# Altium schematic sheet Fri3D_IRA_ESP32.SchDoc: ESP32 Module
size A3; Date: 26/12/2021; DrawnBy: Wim Van Gool; DocumentNumber: 2; Revision: 01; SheetNumber: 2; SheetTotal: 4
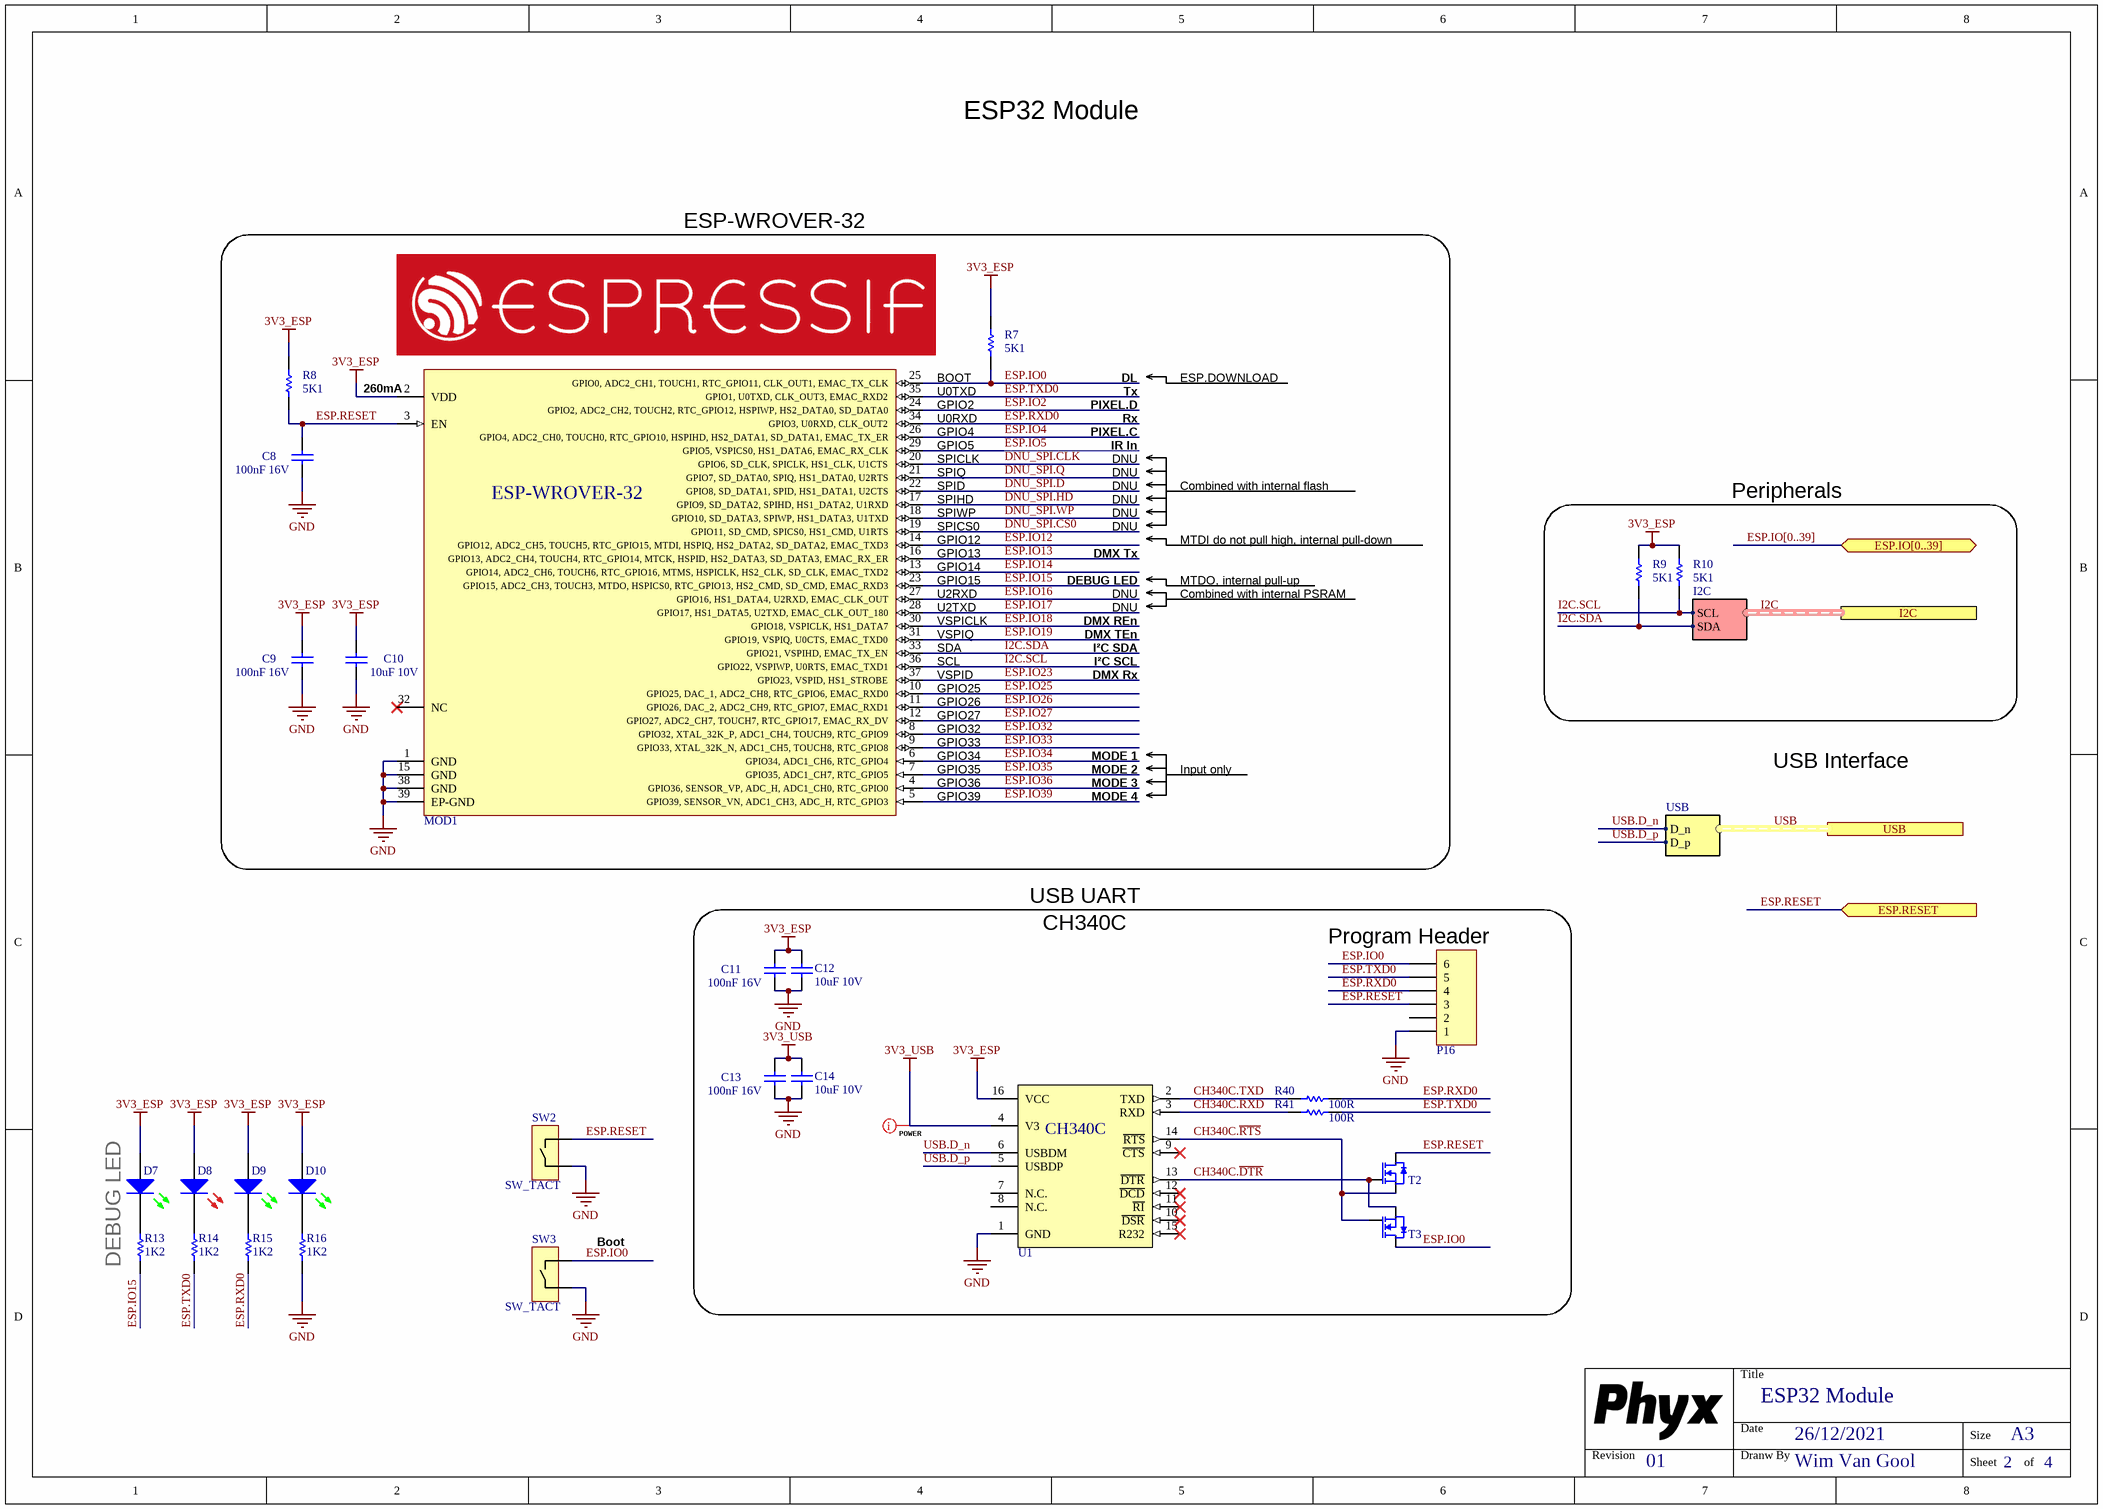
[diagram p0: Fri3D_IRA_ESP32.SchDoc]

## Parts
C8  value 100nF 16V  [C0603_N]
C9  value 100nF 16V  [C0603_N]
C10  value 10uF 10V  [C0805_N]  (hidden comment: CAP_CERAMIC)
C11  value 100nF 16V  [C0603_N]
C12  value 10uF 10V  [C0805_N]  (hidden comment: CAP_CERAMIC)
C13  value 100nF 16V  [C0603_N]
C14  value 10uF 10V  [C0805_N]  (hidden comment: CAP_CERAMIC)
D7  Default 0805 Green LED  [LED_0805_GR]  (value not drawn)
D8  Default 0805 Red LED  [LED_0805_RD]  (value not drawn)
D9  Default 0805 Green LED  [LED_0805_GR]  (value not drawn)
D10  Default 0805 Green LED  [LED_0805_GR]  (value not drawn)
MOD1  ESP-32 based ESP-WROVER-32  [ESP-WROVER-32]  (value not drawn)
P16  Header 6  [HDR1X6]  (value not drawn)
R7  value 5K1  [R0603_N]  (hidden comment: RESISTOR)
R8  value 5K1  [R0603_N]  (hidden comment: RESISTOR)
R9  value 5K1  [R0603_N]  (hidden comment: RESISTOR)
R10  value 5K1  [R0603_N]  (hidden comment: RESISTOR)
R13  value 1K2  [R0603_N]  (hidden comment: RESISTOR)
R14  value 1K2  [R0603_N]  (hidden comment: RESISTOR)
R15  value 1K2  [R0603_N]  (hidden comment: RESISTOR)
R16  value 1K2  [R0603_N]  (hidden comment: RESISTOR)
R40  value 100R  [R0603_N]  (hidden comment: RESISTOR)
R41  value 100R  [R0603_N]  (hidden comment: RESISTOR)
SW2  SW_TACT  [WE_430181038816]
SW3  SW_TACT  [WE_430181038816]
T2  0.2A N-Ch MOSFET Vgs 3.2  [SOT23-3]  (value not drawn)
T3  0.2A N-Ch MOSFET Vgs 3.2  [SOT23-3]  (value not drawn)
U1  USB to full UART with internal crystal  [SOIC_N_16]  (value not drawn)

## Blocks framed on the sheet
ESP-WROVER-32: C8-C10 MOD1 R7 R8
Peripherals: R9 R10

## Ports
ESP.IO[0..39] (bidir), ESP.RESET (in), I2C (harness I2C), USB (harness USB)

## Harnesses
I2C: SDA, SCL
USB: D_p, D_n

## Nets
3V3_ESP: C9.1 C10.1 C11.1 C12.2 D7.1(A) D8.1(A) D9.1(A) D10.1(A) MOD1.2(VDD) R7.1 R8.1 R9.1 R10.1 U1.16(VCC)
3V3_USB: C13.1 C14.2 U1.4(V3)
GND: C8.2 C9.2 C10.2 C11.2 C12.1 C13.2 C14.1 MOD1.1(GND) MOD1.15(GND) MOD1.38(GND) MOD1.39(EP-GND) P16.1 R16.2 SW2.2 SW3.2 U1.1(GND)
CH340C.~{DTR}: T2.1(G) T3.2(S) U1.13(~{DTR})
CH340C.~{RTS}: T2.2(S) T3.1(G) U1.14(~{RTS})
CH340C.RXD: R41.1 U1.3(RXD)
CH340C.TXD: R40.1 U1.2(TXD)
DNU_SPI.CLK: MOD1.20(GPIO6,_SD_CLK,_SPICLK,_HS1_CLK,_U1CTS)
DNU_SPI.CS0: MOD1.19(GPIO11,_SD_CMD,_SPICS0,_HS1_CMD,_U1RTS)
DNU_SPI.D: MOD1.22(GPIO8,_SD_DATA1,_SPID,_HS1_DATA1,_U2CTS)
DNU_SPI.HD: MOD1.17(GPIO9,_SD_DATA2,_SPIHD,_HS1_DATA2,_U1RXD)
DNU_SPI.Q: MOD1.21(GPIO7,_SD_DATA0,_SPIQ,_HS1_DATA0,_U2RTS)
DNU_SPI.WP: MOD1.18(GPIO10,_SD_DATA3,_SPIWP,_HS1_DATA3,_U1TXD)
ESP.IO0: MOD1.25(GPIO0,_ADC2_CH1,_TOUCH1,_RTC_GPIO11,_CLK_OUT1,_EMAC_TX_CLK) P16.6 R7.2 SW3.1 T3.3(D)
ESP.IO2: MOD1.24(GPIO2,_ADC2_CH2,_TOUCH2,_RTC_GPIO12,_HSPIWP,_HS2_DATA0,_SD_DATA0)
ESP.IO4: MOD1.26(GPIO4,_ADC2_CH0,_TOUCH0,_RTC_GPIO10,_HSPIHD,_HS2_DATA1,_SD_DATA1,_EMAC_TX_ER)
ESP.IO5: MOD1.29(GPIO5,_VSPICS0,_HS1_DATA6,_EMAC_RX_CLK)
ESP.IO12: MOD1.14(GPIO12,_ADC2_CH5,_TOUCH5,_RTC_GPIO15,_MTDI,_HSPIQ,_HS2_DATA2,_SD_DATA2,_EMAC_TXD3)
ESP.IO13: MOD1.16(GPIO13,_ADC2_CH4,_TOUCH4,_RTC_GPIO14,_MTCK,_HSPID,_HS2_DATA3,_SD_DATA3,_EMAC_RX_ER)
ESP.IO14: MOD1.13(GPIO14,_ADC2_CH6,_TOUCH6,_RTC_GPIO16,_MTMS,_HSPICLK,_HS2_CLK,_SD_CLK,_EMAC_TXD2)
ESP.IO15: MOD1.23(GPIO15,_ADC2_CH3,_TOUCH3,_MTDO,_HSPICS0,_RTC_GPIO13,_HS2_CMD,_SD_CMD,_EMAC_RXD3) R13.2
ESP.IO16: MOD1.27(GPIO16,_HS1_DATA4,_U2RXD,_EMAC_CLK_OUT)
ESP.IO17: MOD1.28(GPIO17,_HS1_DATA5,_U2TXD,_EMAC_CLK_OUT_180)
ESP.IO18: MOD1.30(GPIO18,_VSPICLK,_HS1_DATA7)
ESP.IO19: MOD1.31(GPIO19,_VSPIQ,_U0CTS,_EMAC_TXD0)
ESP.IO23: MOD1.37(GPIO23,_VSPID,_HS1_STROBE)
ESP.IO25: MOD1.10(GPIO25,_DAC_1,_ADC2_CH8,_RTC_GPIO6,_EMAC_RXD0)
ESP.IO26: MOD1.11(GPIO26,_DAC_2,_ADC2_CH9,_RTC_GPIO7,_EMAC_RXD1)
ESP.IO27: MOD1.12(GPIO27,_ADC2_CH7,_TOUCH7,_RTC_GPIO17,_EMAC_RX_DV)
ESP.IO32: MOD1.8(GPIO32,_XTAL_32K_P,_ADC1_CH4,_TOUCH9,_RTC_GPIO9)
ESP.IO33: MOD1.9(GPIO33,_XTAL_32K_N,_ADC1_CH5,_TOUCH8,_RTC_GPIO8)
ESP.IO34: MOD1.6(GPIO34,_ADC1_CH6,_RTC_GPIO4)
ESP.IO35: MOD1.7(GPIO35,_ADC1_CH7,_RTC_GPIO5)
ESP.IO36: MOD1.4(GPIO36,_SENSOR_VP,_ADC_H,_ADC1_CH0,_RTC_GPIO0)
ESP.IO39: MOD1.5(GPIO39,_SENSOR_VN,_ADC1_CH3,_ADC_H,_RTC_GPIO3)
ESP.RESET: C8.1 MOD1.3(EN) P16.3 R8.2 SW2.1 T2.3(D) ; port ESP.RESET
ESP.RXD0: MOD1.34(GPIO3,_U0RXD,_CLK_OUT2) P16.4 R15.2 R40.2
ESP.TXD0: MOD1.35(GPIO1,_U0TXD,_CLK_OUT3,_EMAC_RXD2) P16.5 R14.2 R41.2
I2C.SCL: MOD1.36(GPIO22,_VSPIWP,_U0RTS,_EMAC_TXD1) R10.2 ; port I2C.SCL
I2C.SDA: MOD1.33(GPIO21,_VSPIHD,_EMAC_TX_EN) R9.2 ; port I2C.SDA
USB.D_n: U1.6(USBDM) ; port USB.D_n
USB.D_p: U1.5(USBDP) ; port USB.D_p
NetD7_2: D7.2(K) R13.1
NetD8_2: D8.2(K) R14.1
NetD9_2: D9.2(K) R15.1
NetD10_2: D10.2(K) R16.1

Not connected (* = marked no-connect by the designer): MOD1 32(NC)*; P16 2; U1 7(N.C.) 8(N.C.) 9(~{CTS})* 10(~{DSR})* 11(~{RI})* 12(~{DCD})* 15(R232)*

## Buses and harness runs
bus ESP.IO[0..39] = port ESP.IO[0..39]
harness I2C = port I2C
harness USB = port USB

## Layout directives
net class POWER: 3V3_USB

## Notes on the sheet
- BOOT
- U0TXD
- DL
- Tx
- ESP.DOWNLOAD
- (near MOD1) 260mA
- (near MOD1) SPICLK
- U0RXD
- GPIO2
- (near MOD1) GPIO4
- (near MOD1) GPIO5
- IR In
- Rx
- DNU
- PIXEL.D
- PIXEL.C
- (near MOD1) SPIQ
- (near MOD1) SPID
- (near MOD1) SPIHD
- (near MOD1) SPIWP
- (near MOD1) SPICS0
- Combined with internal flash
- (near MOD1) U2RXD
- (near MOD1) GPIO12
- (near MOD1) GPIO13
- (near MOD1) GPIO14
- (near MOD1) GPIO15
- DEBUG LED
- DMX Tx
- MTDI do not pull high, internal pull-down
- MTDO, internal pull-up
- Combined with internal PSRAM
- (near MOD1) SDA
- (near MOD1) SCL
- (near MOD1) VSPICLK
- (near MOD1) VSPIQ
- (near MOD1) U2TXD
- I²C SDA
- I²C SCL
- DMX REn
- DMX TEn
- (near MOD1) VSPID
- (near MOD1) GPIO25
- (near MOD1) GPIO26
- (near MOD1) GPIO27
- (near MOD1) GPIO32
- DMX Rx
- (near MOD1) GPIO34
- (near MOD1) GPIO35
- (near MOD1) GPIO36
- (near MOD1) GPIO39
- (near MOD1) GPIO33
- MODE 1
- MODE 2
- MODE 3
- MODE 4
- Input only
- USB Interface
- USB UART
- CH340C
- (near P16) Program Header
- (near SW3) Boot
- Title
- Revision
- Date
- Dranw By
- Size
- A3
- Sheet
- of

## Library data of the parts
C8 C9 C11 C13 = CAP # 100nF 16V 0603: Capacitor Ceramic
C10 C12 C14 = CAP # 10uF 10V 0805: Capacitor Ceramic; Supplier 1: Farnell; Supplier Part Number 1: 2320859
D7 D9 D10 = LED # Green 0805: =Description; Supplier 1: Farnell; Supplier Part Number 1: 2099239
D8 = LED # Red 0805: =Description; Supplier 1: Farnell; Supplier Part Number 1: 2099236
MOD1 = WiFi # MOD ESP-WROVER-32: Value: ESP-WROVER-32; Supplier 1: Espressif; Supplier Part Number 1: ESP-WROVER-32
P16 = Pin Header 2.54mm 6way
R7-R10 = RES # 5K1 0603: Supplier 1: Farnell; Supplier Part Number 1: 2845922
R13-R16 = RES # 1K2 0603
R40 R41 = RES # 100R 0603
SW2 SW3 = SW # TACT small 4.5x4.5mm SMD WS-TASV
T2 T3 = BSS138 N-Ch MOSFET 0.2A 3.2Vgs 60Vds: Value: BSS138; Supplier 1: Farnell; Supplier Part Number 1: 2432717
U1 = CH340C # UCB UART: =Description; Value: CH340C; Supplier 1: LCSC; Supplier Part Number 1: C84681